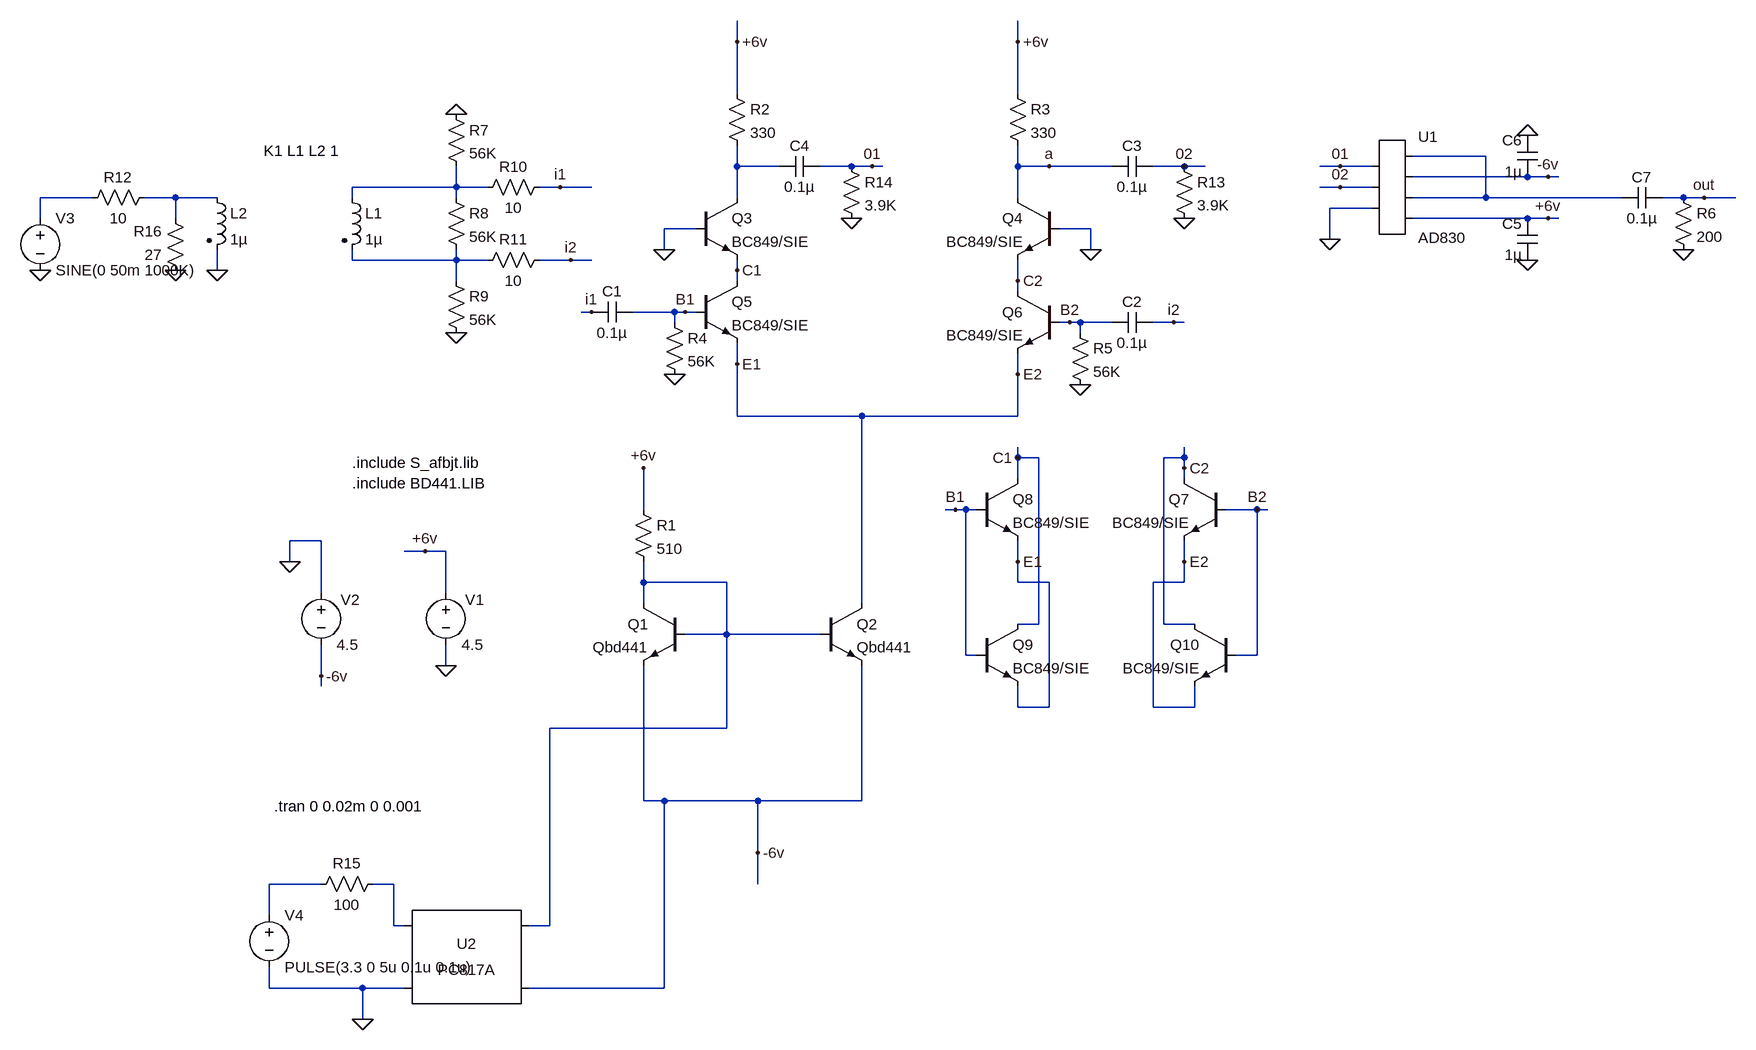
[diagram p0: schematic amplifier.asc]
amplifier.asc, the LTspice schematic file:
Version 4
SHEET 1 2036 900
WIRE 496 -624 496 -656
WIRE 928 -624 928 -656
WIRE 496 -544 496 -624
WIRE 928 -544 928 -624
WIRE 1648 -448 1536 -448
WIRE 496 -432 496 -464
WIRE 560 -432 496 -432
WIRE 672 -432 624 -432
WIRE 704 -432 672 -432
WIRE 720 -432 704 -432
WIRE 928 -432 928 -464
WIRE 976 -432 928 -432
WIRE 1072 -432 976 -432
WIRE 1184 -432 1136 -432
WIRE 1216 -432 1184 -432
WIRE 1424 -432 1392 -432
WIRE 1472 -432 1424 -432
WIRE 1712 -416 1536 -416
WIRE 1744 -416 1712 -416
WIRE 1760 -416 1744 -416
WIRE 64 -400 64 -432
WIRE 64 -400 -96 -400
WIRE 112 -400 64 -400
WIRE 224 -400 192 -400
WIRE 272 -400 224 -400
WIRE 1424 -400 1392 -400
WIRE 1472 -400 1424 -400
WIRE -496 -384 -576 -384
WIRE -368 -384 -416 -384
WIRE -304 -384 -368 -384
WIRE -96 -384 -96 -400
WIRE 64 -384 64 -400
WIRE 496 -384 496 -432
WIRE 928 -384 928 -432
WIRE 1648 -384 1648 -448
WIRE 1648 -384 1536 -384
WIRE 1856 -384 1648 -384
WIRE 1952 -384 1920 -384
WIRE 1984 -384 1952 -384
WIRE 2032 -384 1984 -384
WIRE 1472 -368 1408 -368
WIRE -576 -352 -576 -384
WIRE -368 -352 -368 -384
WIRE 1712 -352 1536 -352
WIRE 1744 -352 1712 -352
WIRE 1760 -352 1744 -352
WIRE 432 -336 384 -336
WIRE 1040 -336 992 -336
WIRE 1408 -320 1408 -368
WIRE 384 -304 384 -336
WIRE 1040 -304 1040 -336
WIRE -96 -288 -96 -304
WIRE 64 -288 64 -304
WIRE 64 -288 -96 -288
WIRE 112 -288 64 -288
WIRE 240 -288 192 -288
WIRE 272 -288 240 -288
WIRE -304 -272 -304 -304
WIRE 496 -272 496 -288
WIRE 64 -256 64 -288
WIRE 496 -256 496 -272
WIRE 928 -256 928 -288
WIRE 928 -240 928 -256
WIRE 272 -208 256 -208
WIRE 400 -208 336 -208
WIRE 416 -208 400 -208
WIRE 432 -208 416 -208
WIRE 400 -192 400 -208
WIRE 1008 -192 992 -192
WIRE 1024 -192 1008 -192
WIRE 1072 -192 1024 -192
WIRE 1168 -192 1136 -192
WIRE 1184 -192 1168 -192
WIRE 1024 -176 1024 -192
WIRE 496 -128 496 -160
WIRE 928 -112 928 -144
WIRE 496 -48 496 -128
WIRE 688 -48 496 -48
WIRE 928 -48 928 -112
WIRE 928 -48 688 -48
WIRE 928 16 928 0
WIRE 960 16 928 16
WIRE 1184 16 1184 0
WIRE 1184 16 1152 16
WIRE 1184 32 1184 16
WIRE 928 48 928 16
WIRE 1184 48 1184 32
WIRE 352 96 352 32
WIRE 832 96 816 96
WIRE 848 96 832 96
WIRE 864 96 848 96
WIRE 1296 96 1248 96
WIRE 1312 96 1296 96
WIRE -144 144 -192 144
WIRE 16 160 -16 160
WIRE 48 160 16 160
WIRE -192 176 -192 144
WIRE 928 176 928 144
WIRE 1184 176 1184 144
WIRE 352 208 352 176
WIRE 480 208 352 208
WIRE 928 208 928 176
WIRE 976 208 928 208
WIRE 1184 208 1184 176
WIRE 1184 208 1136 208
WIRE -144 224 -144 144
WIRE 48 224 48 160
WIRE 352 240 352 208
WIRE 688 240 688 -48
WIRE 960 272 960 16
WIRE 960 272 928 272
WIRE 1152 272 1152 16
WIRE 1200 272 1152 272
WIRE 480 288 480 208
WIRE 480 288 416 288
WIRE 624 288 480 288
WIRE 848 320 848 96
WIRE 864 320 848 320
WIRE 1296 320 1296 96
WIRE 1296 320 1264 320
WIRE 48 336 48 304
WIRE -144 352 -144 304
WIRE -144 368 -144 352
WIRE 928 400 928 368
WIRE 976 400 976 208
WIRE 976 400 928 400
WIRE 1136 400 1136 208
WIRE 1200 400 1200 368
WIRE 1200 400 1136 400
WIRE 480 432 480 288
WIRE 480 432 208 432
WIRE 352 544 352 336
WIRE 384 544 352 544
WIRE 528 544 384 544
WIRE 688 544 688 336
WIRE 688 544 528 544
WIRE 528 624 528 544
WIRE -144 672 -224 672
WIRE -32 672 -64 672
WIRE 528 672 528 624
WIRE -224 720 -224 672
WIRE -32 736 -32 672
WIRE -16 736 -32 736
WIRE 208 736 208 432
WIRE 208 736 176 736
WIRE -224 832 -224 800
WIRE -80 832 -224 832
WIRE -16 832 -80 832
WIRE 384 832 384 544
WIRE 384 832 176 832
WIRE -80 880 -80 832
FLAG 48 336 0
FLAG 16 160 +6v
FLAG 352 32 +6v
FLAG -192 176 0
FLAG -144 352 -6v
FLAG 528 624 -6v
FLAG 496 -624 +6v
FLAG 928 -624 +6v
FLAG 384 -304 0
FLAG 1040 -304 0
FLAG 400 -112 0
FLAG 1024 -96 0
FLAG 704 -432 01
FLAG 1424 -432 01
FLAG 1184 -432 02
FLAG 1424 -400 02
FLAG 1408 -320 0
FLAG 1712 -288 0
FLAG 1712 -480 0
FLAG 1744 -352 +6v
FLAG 1744 -416 -6v
FLAG 1984 -384 out
FLAG 1952 -304 0
FLAG 64 -176 0
FLAG 64 -512 0
FLAG 224 -400 i1
FLAG 272 -208 i1
FLAG 240 -288 i2
FLAG 1168 -192 i2
FLAG -304 -272 0
FLAG -576 -272 0
FLAG 672 -352 0
FLAG 1184 -352 0
FLAG 416 -208 B1
FLAG 832 96 B1
FLAG 496 -272 C1
FLAG 928 16 C1
FLAG 496 -128 E1
FLAG 928 176 E1
FLAG 1008 -192 B2
FLAG 1296 96 B2
FLAG 928 -256 C2
FLAG 1184 32 C2
FLAG 928 -112 E2
FLAG 1184 176 E2
FLAG -80 880 0
FLAG -368 -272 0
FLAG 976 -432 a
SYMBOL npn 416 240 M0
SYMATTR InstName Q1
SYMATTR Value Qbd441
SYMBOL voltage 48 208 R0
WINDOW 0 30 27 Left 2
WINDOW 123 0 0 Left 0
WINDOW 39 0 0 Left 0
SYMATTR InstName V1
SYMATTR Value 4.5
SYMBOL res 336 80 R0
SYMATTR InstName R1
SYMATTR Value 510
SYMBOL npn 624 240 R0
SYMATTR InstName Q2
SYMATTR Value Qbd441
SYMBOL voltage -144 208 R0
WINDOW 0 30 27 Left 2
WINDOW 123 0 0 Left 0
WINDOW 39 0 0 Left 0
SYMATTR InstName V2
SYMATTR Value 4.5
SYMBOL res 480 -560 R0
SYMATTR InstName R2
SYMATTR Value 330
SYMBOL res 912 -560 R0
SYMATTR InstName R3
SYMATTR Value 330
SYMBOL npn 432 -384 R0
SYMATTR InstName Q3
SYMATTR Value BC849/SIE
SYMBOL npn 992 -384 M0
SYMATTR InstName Q4
SYMATTR Value BC849/SIE
SYMBOL npn 432 -256 R0
SYMATTR InstName Q5
SYMATTR Value BC849/SIE
SYMBOL res 384 -208 R0
SYMATTR InstName R4
SYMATTR Value 56K
SYMBOL res 1008 -192 R0
SYMATTR InstName R5
SYMATTR Value 56K
SYMBOL npn 992 -240 M0
SYMATTR InstName Q6
SYMATTR Value BC849/SIE
SYMBOL cap 336 -224 R90
WINDOW 0 0 32 VBottom 2
WINDOW 3 32 32 VTop 2
SYMATTR InstName C1
SYMATTR Value 0.1µ
SYMBOL cap 1136 -208 R90
WINDOW 0 0 32 VBottom 2
WINDOW 3 32 32 VTop 2
SYMATTR InstName C2
SYMATTR Value 0.1µ
SYMBOL AutoGenerated\\AD830 1504 -400 R0
SYMATTR InstName U1
SYMBOL cap 1136 -448 R90
WINDOW 0 0 32 VBottom 2
WINDOW 3 32 32 VTop 2
SYMATTR InstName C3
SYMATTR Value 0.1µ
SYMBOL cap 624 -448 R90
WINDOW 0 0 32 VBottom 2
WINDOW 3 32 32 VTop 2
SYMATTR InstName C4
SYMATTR Value 0.1µ
SYMBOL cap 1728 -288 R180
WINDOW 0 24 56 Left 2
WINDOW 3 24 8 Left 2
SYMATTR InstName C5
SYMATTR Value 1µ
SYMBOL cap 1728 -416 R180
WINDOW 0 24 56 Left 2
WINDOW 3 24 8 Left 2
SYMATTR InstName C6
SYMATTR Value 1µ
SYMBOL cap 1920 -400 R90
WINDOW 0 0 32 VBottom 2
WINDOW 3 32 32 VTop 2
SYMATTR InstName C7
SYMATTR Value 0.1µ
SYMBOL res 1936 -400 R0
SYMATTR InstName R6
SYMATTR Value 200
SYMBOL ind2 -112 -400 R0
SYMATTR InstName L1
SYMATTR Value 1µ
SYMATTR Type ind
SYMBOL ind2 -320 -400 R0
SYMATTR InstName L2
SYMATTR Value 1µ
SYMATTR Type ind
SYMBOL res 48 -528 R0
SYMATTR InstName R7
SYMATTR Value 56K
SYMBOL res 48 -400 R0
SYMATTR InstName R8
SYMATTR Value 56K
SYMBOL res 48 -272 R0
SYMATTR InstName R9
SYMATTR Value 56K
SYMBOL res 208 -416 R90
WINDOW 0 0 56 VBottom 2
WINDOW 3 32 56 VTop 2
SYMATTR InstName R10
SYMATTR Value 10
SYMBOL res 208 -304 R90
WINDOW 0 0 56 VBottom 2
WINDOW 3 32 56 VTop 2
SYMATTR InstName R11
SYMATTR Value 10
SYMBOL voltage -576 -368 R0
WINDOW 123 0 0 Left 0
WINDOW 39 0 0 Left 0
SYMATTR InstName V3
SYMATTR Value SINE(0 50m 1000K)
SYMBOL res -400 -400 R90
WINDOW 0 0 56 VBottom 2
WINDOW 3 32 56 VTop 2
SYMATTR InstName R12
SYMATTR Value 10
SYMBOL res 1168 -448 R0
SYMATTR InstName R13
SYMATTR Value 3.9K
SYMBOL res 656 -448 R0
SYMATTR InstName R14
SYMATTR Value 3.9K
SYMBOL npn 1248 48 M0
SYMATTR InstName Q7
SYMATTR Value BC849/SIE
SYMBOL npn 864 48 R0
SYMATTR InstName Q8
SYMATTR Value BC849/SIE
SYMBOL npn 864 272 R0
SYMATTR InstName Q9
SYMATTR Value BC849/SIE
SYMBOL npn 1264 272 M0
SYMATTR InstName Q10
SYMATTR Value BC849/SIE
SYMBOL Optos\\PC817A 80 784 R0
SYMATTR InstName U2
SYMBOL voltage -224 704 R0
WINDOW 123 0 0 Left 0
WINDOW 39 0 0 Left 0
SYMATTR InstName V4
SYMATTR Value PULSE(3.3 0 5u 0.1u 0.1u)
SYMBOL res -48 656 R90
WINDOW 0 0 56 VBottom 2
WINDOW 3 32 56 VTop 2
SYMATTR InstName R15
SYMATTR Value 100
SYMBOL res -352 -256 R180
WINDOW 0 36 76 Left 2
WINDOW 3 36 40 Left 2
SYMATTR InstName R16
SYMATTR Value 27
TEXT -96 24 Left 2 !.include S_afbjt.lib\n.include BD441.LIB
TEXT -216 552 Left 2 !.tran 0 0.02m 0 0.001
TEXT -232 -456 Left 2 !K1 L1 L2 1

The netlist it stands for:
* amplifier.asc
Q1 N007 N007 -6v 0 Qbd441
V1 +6v 0 4.5
R1 +6v N007 510
Q2 E2 N007 -6v 0 Qbd441
V2 0 -6v 4.5
R2 +6v N002 330
R3 +6v a 330
Q3 N002 0 C1 0 BC849/SIE
Q4 a 0 C2 0 BC849/SIE
Q5 C1 B1 E2 0 BC849/SIE
R4 B1 0 56K
R5 B2 0 56K
Q6 C2 B2 E2 0 BC849/SIE
C1 B1 i1 0.1µ
C2 i2 B2 0.1µ
* U1: AD830 (symbol AutoGenerated\AD830 not available, pins judged from their places): pin1=01 pin2=02 pin3=0 pin4=N001 pin5=-6v pin6=N001 pin7=+6v
C3 02 a 0.1µ
C4 01 N002 0.1µ
C5 0 +6v 1µ
C6 -6v 0 1µ
C7 out N001 0.1µ
R6 out 0 200
L1 N003 N006 1µ
L2 N005 0 1µ
R7 0 N003 56K
R8 N003 N006 56K
R9 N006 0 56K
R10 i1 N003 10
R11 i2 N006 10
V3 N004 0 SINE(0 50m 1000K)
R12 N005 N004 10
R13 02 0 3.9K
R14 01 0 3.9K
Q7 C2 B2 E2 0 BC849/SIE
Q8 C1 B1 E2 0 BC849/SIE
Q9 C1 B1 E2 0 BC849/SIE
Q10 C2 B2 E2 0 BC849/SIE
XU2 N009 0 N007 -6v PC817 Igain=1m
V4 N008 0 PULSE(3.3 0 5u 0.1u 0.1u)
R15 N009 N008 100
R16 0 N005 27
.model NPN NPN
.model PNP PNP
.lib standard.bjt
.include S_afbjt.lib
.include BD441.LIB
.tran 0 0.02m 0 0.001
K1 L1 L2 1
.lib PC817.sub
.backanno
.end